# Altium project Main Board V1.1.PrjPCB
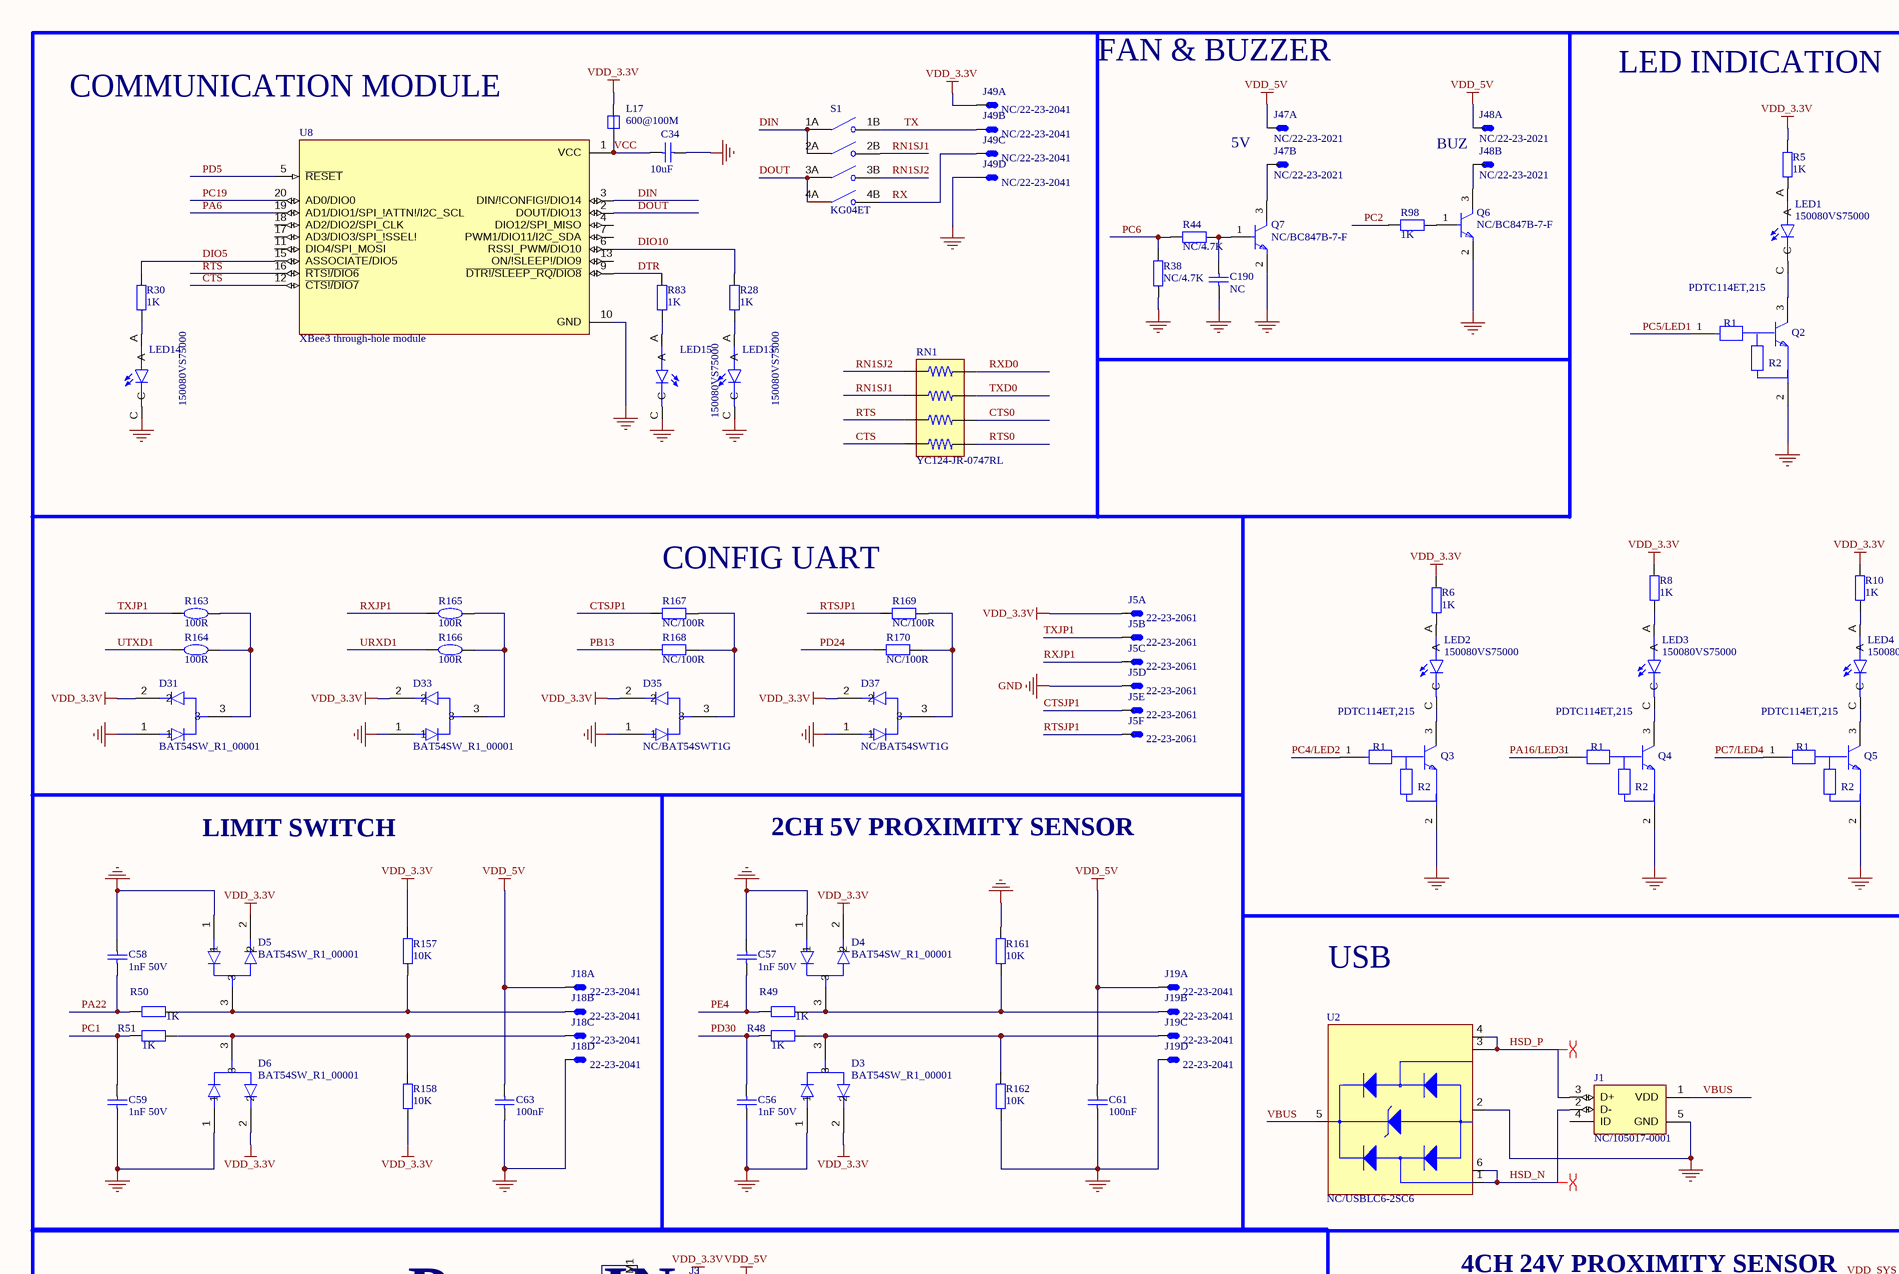
[diagram p0: Ascii of Main Board V1.1.SchDoc, top left]
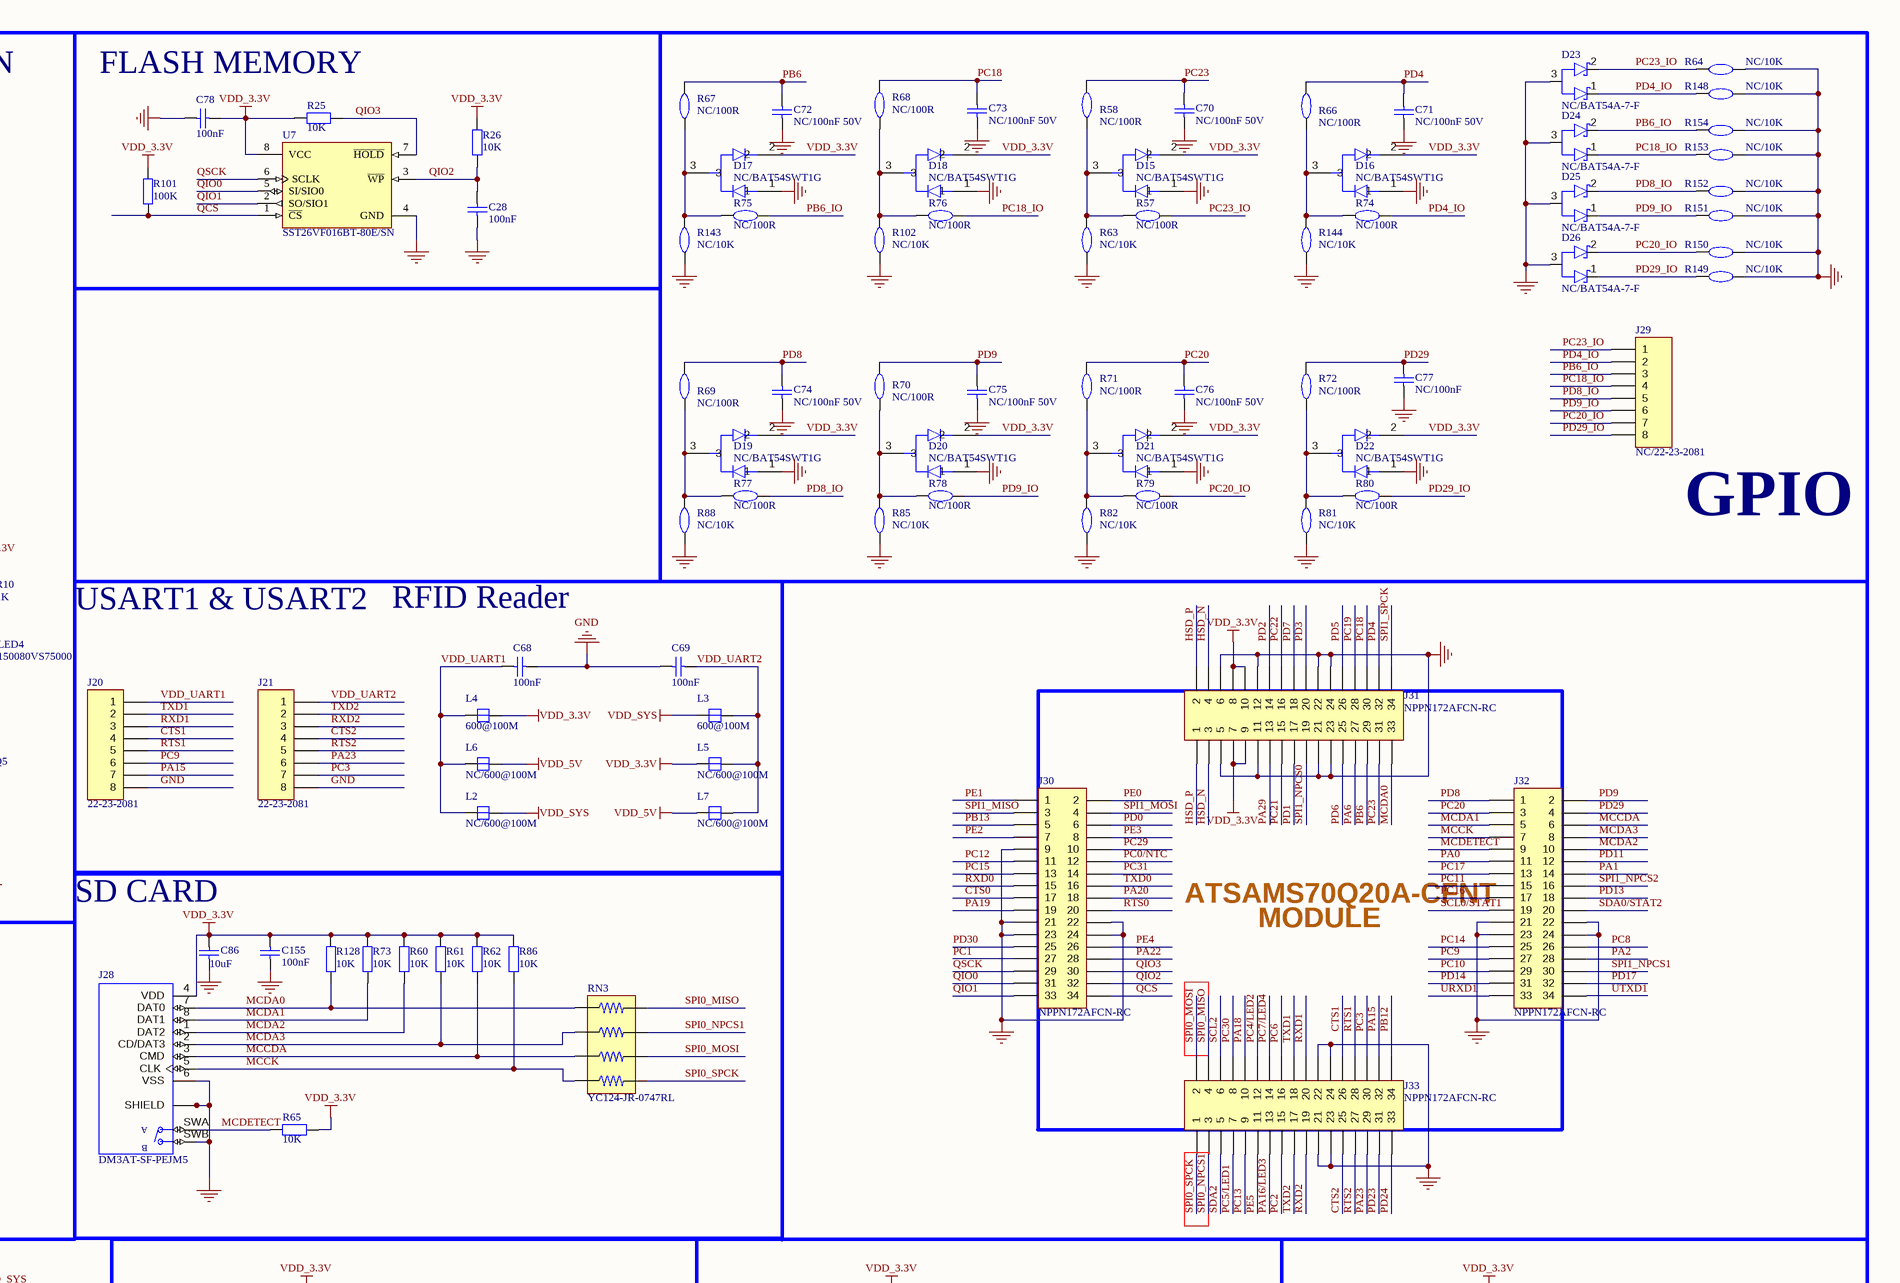
[diagram p1: Ascii of Main Board V1.1.SchDoc, top right]
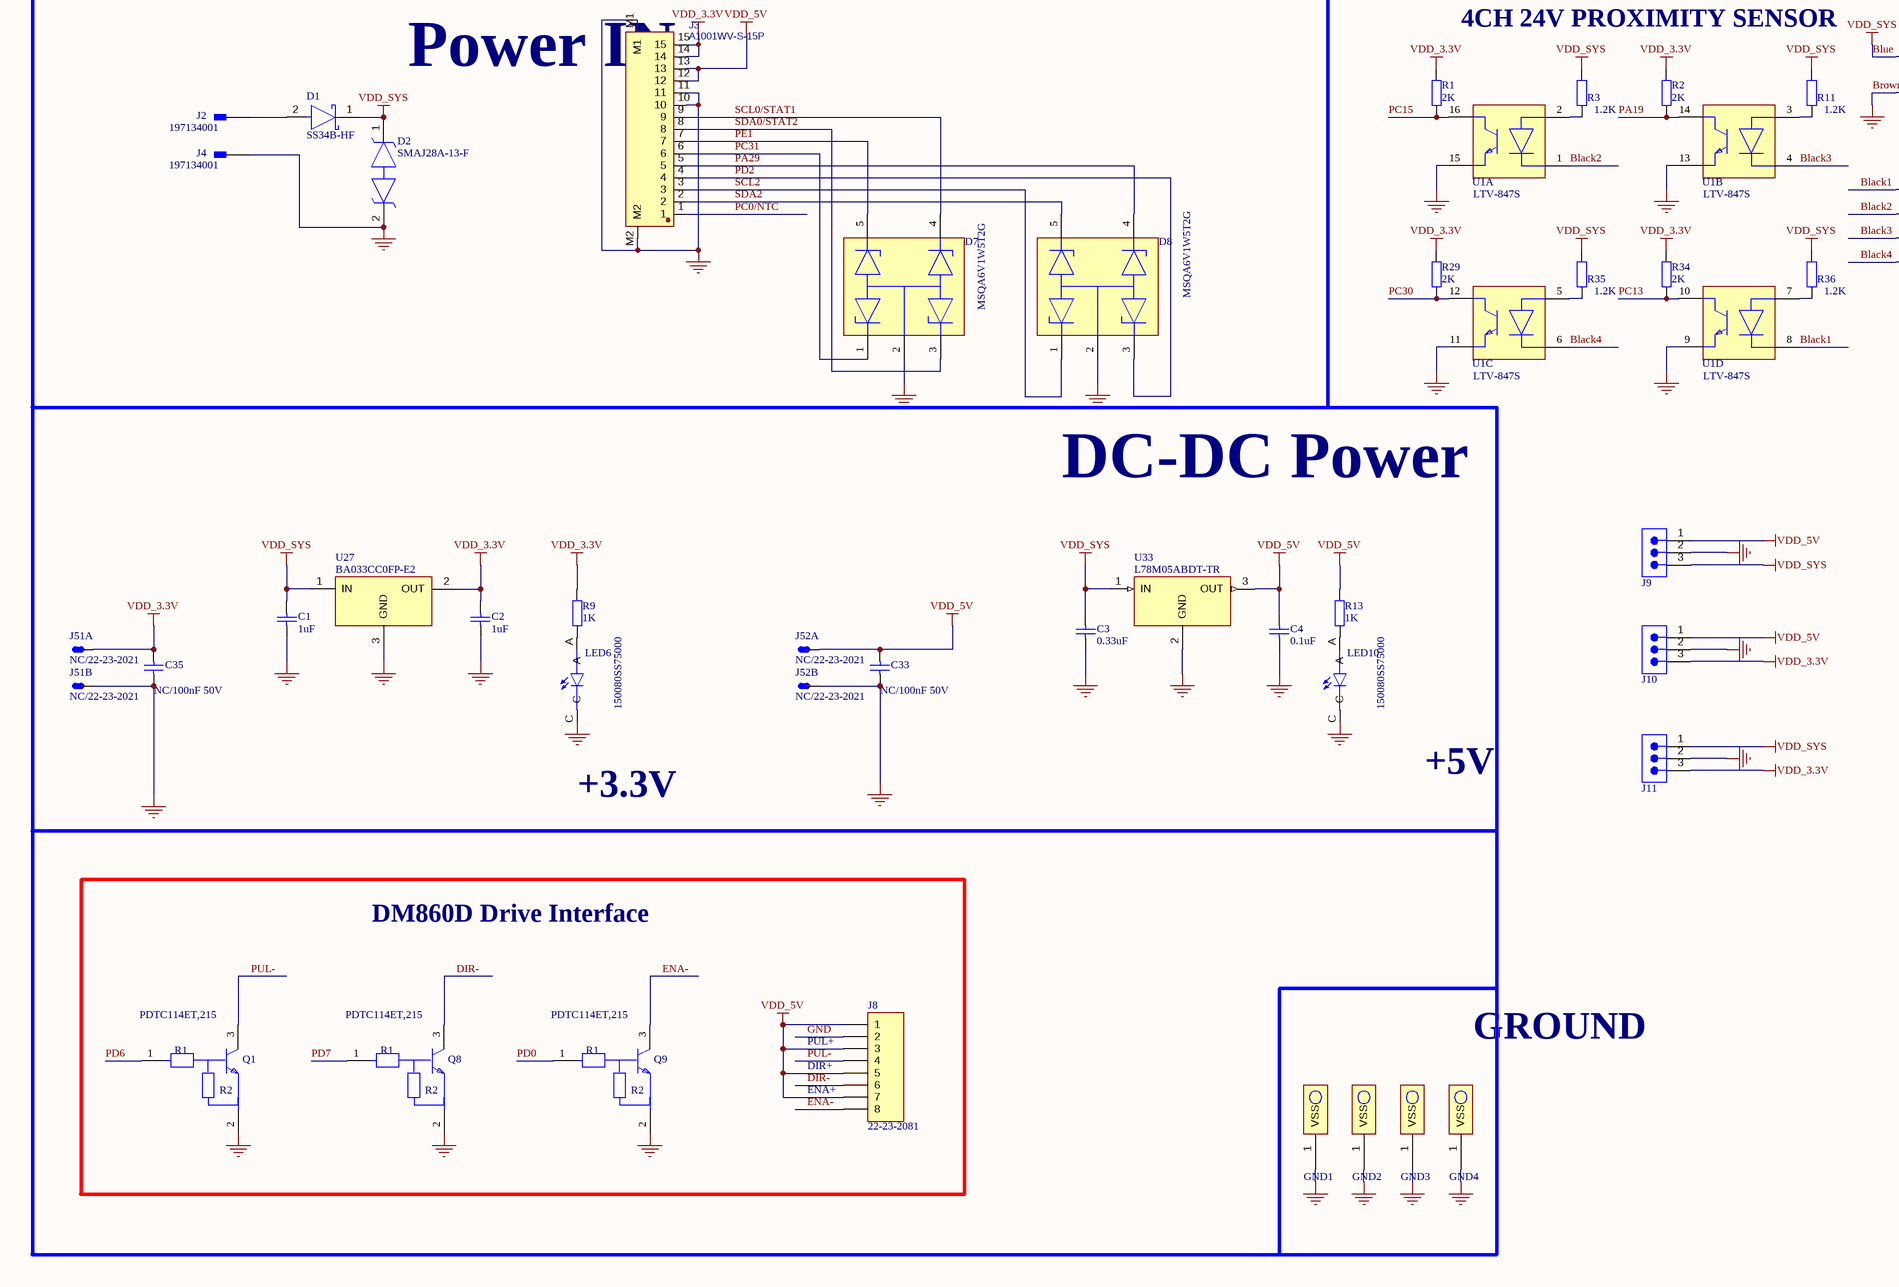
[diagram p2: Ascii of Main Board V1.1.SchDoc, bottom left]
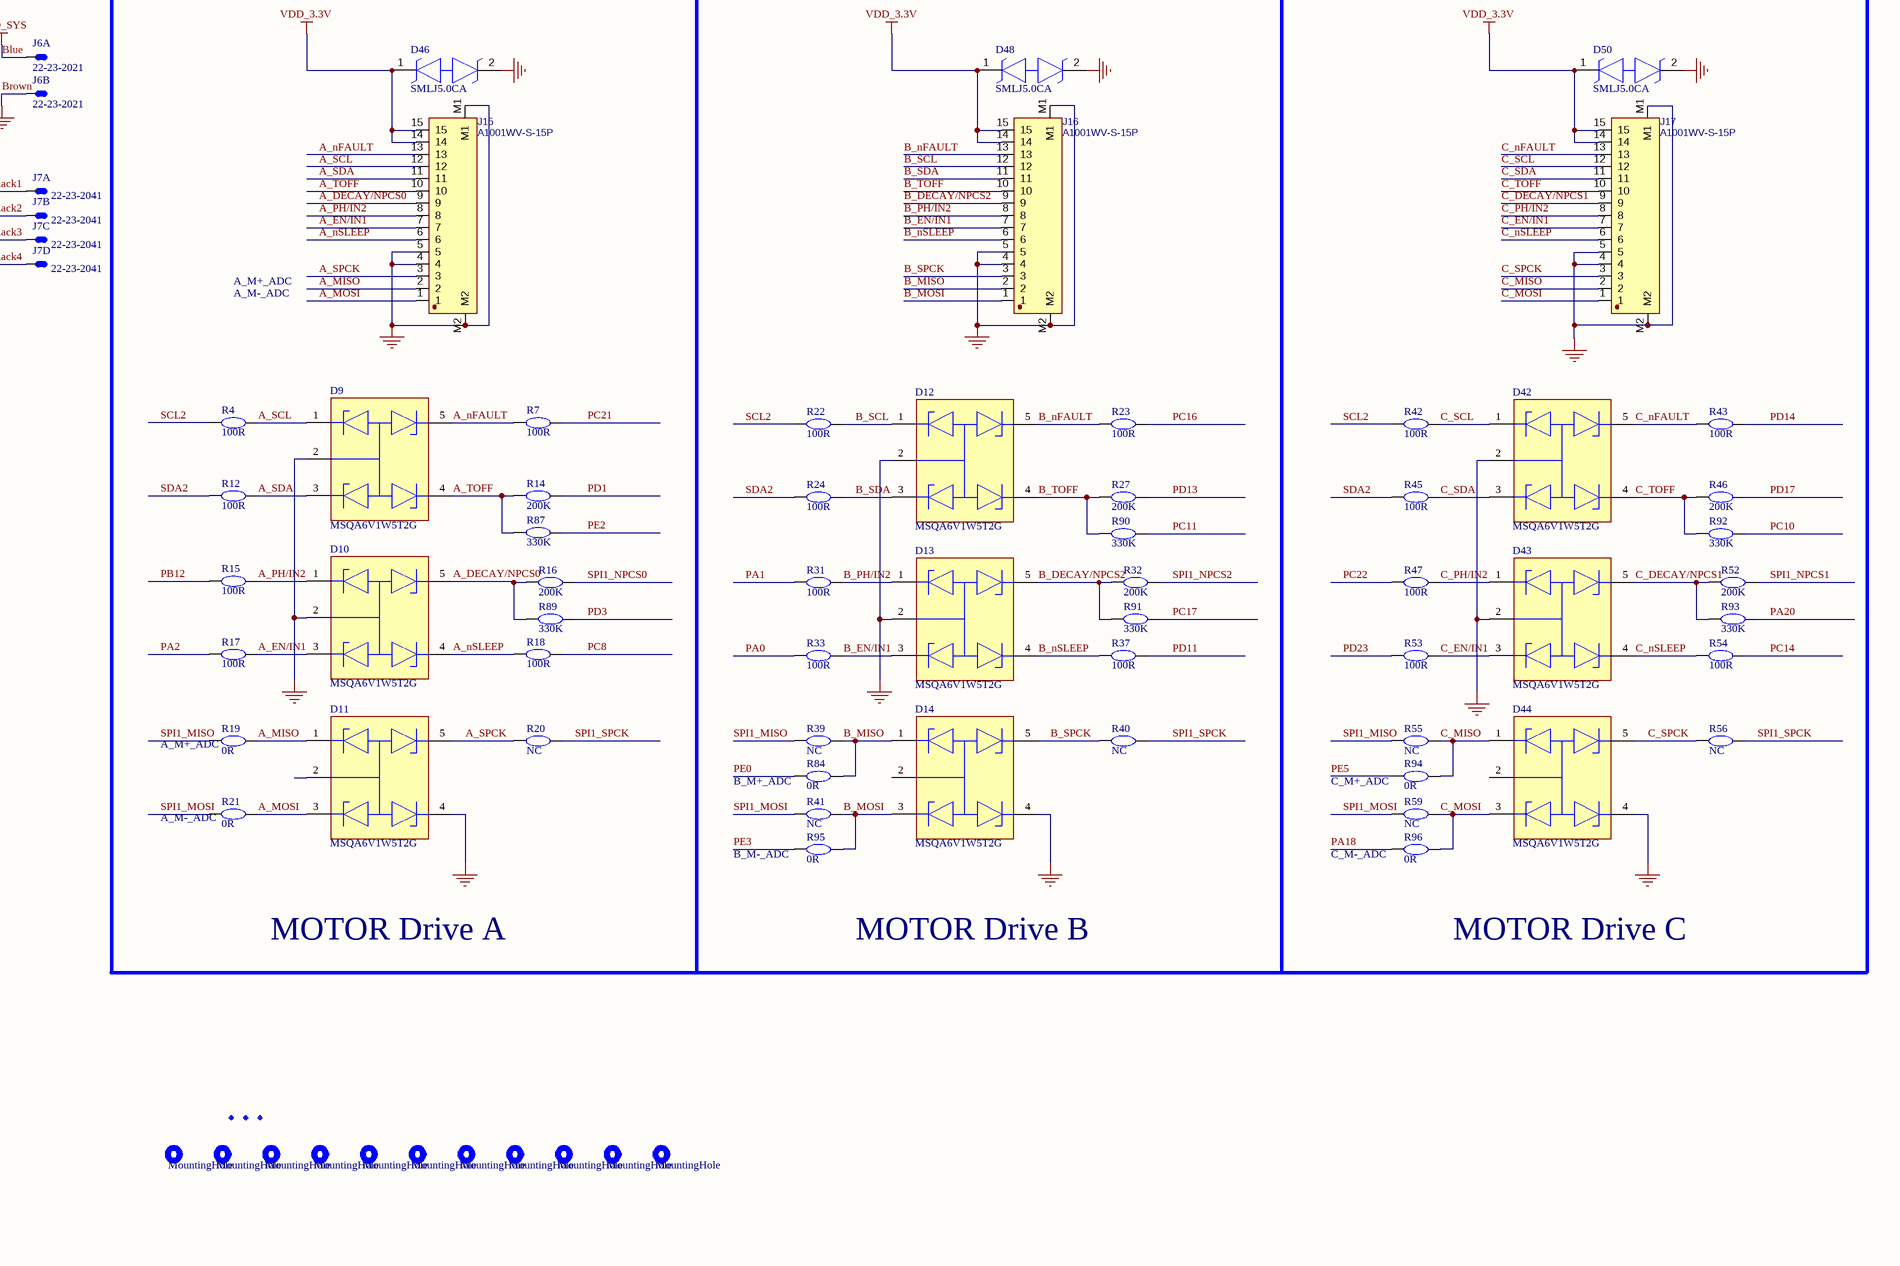
[diagram p3: Ascii of Main Board V1.1.SchDoc, bottom right]
1 sheet, 266 parts. Net scope: global (net labels, ports and power ports of the same name join across sheets).
Board file: Ascii of Main Board V1.1.PcbDoc

## Sheet Ascii of Main Board V1.1.SchDoc
size 863 x 558 mm

### Parts
C1  1uF  [C_0603_1608Metric]
C2  1uF  [C_0603_1608Metric]
C3  0.33uF  [C_0603_1608Metric]
C4  0.1uF  [C_0603_1608Metric]
C28  100nF  [C_0603_1608Metric]
C33  NC/100nF 50V  [C_0603_1608Metric]
C34  10uF  [C_1206_3216Metric]
C35  NC/100nF 50V  [C_0603_1608Metric]
C56  1nF 50V  [C_0603_1608Metric]
C57  1nF 50V  [C_0603_1608Metric]
C58  1nF 50V  [C_0603_1608Metric]
C59  1nF 50V  [C_0603_1608Metric]
C61  100nF  [C_0603_1608Metric]
C63  100nF  [C_0603_1608Metric]
C68  100nF  [C_0603_1608Metric]
C69  100nF  [C_0603_1608Metric]
C70  NC/100nF 50V  [C_0603_1608Metric]
C71  NC/100nF 50V  [C_0603_1608Metric]
C72  NC/100nF 50V  [C_0603_1608Metric]
C73  NC/100nF 50V  [C_0603_1608Metric]
C74  NC/100nF 50V  [C_0603_1608Metric]
C75  NC/100nF 50V  [C_0603_1608Metric]
C76  NC/100nF 50V  [C_0603_1608Metric]
C77  NC/100nF  [C_0603_1608Metric]
C78  100nF  [C_0603_1608Metric]
C86  10uF  [C_1206_3216Metric]
C155  100nF  [C_0603_1608Metric]
C190  NC  [C_0603_1608Metric]
D1  SS34B-HF  [FP-95402-MFG]
D2  SMAJ28A-13-F  [DIONM7959X262N]
D3  BAT54SW_R1_00001  [ONSC-SOT-323-3-419-04_V]
D4  BAT54SW_R1_00001  [ONSC-SOT-323-3-419-04_V]
D5  BAT54SW_R1_00001  [ONSC-SOT-323-3-419-04_V]
D6  BAT54SW_R1_00001  [ONSC-SOT-323-3-419-04_V]
D7  MSQA6V1W5T2G  [SOT95P280X145-5N]
D8  MSQA6V1W5T2G  [SOT95P280X145-5N]
D9  MSQA6V1W5T2G  [SOT95P280X145-5N]
D10  MSQA6V1W5T2G  [SOT95P280X145-5N]
D11  MSQA6V1W5T2G  [SOT95P280X145-5N]
D12  MSQA6V1W5T2G  [SOT95P280X145-5N]
D13  MSQA6V1W5T2G  [SOT95P280X145-5N]
D14  MSQA6V1W5T2G  [SOT95P280X145-5N]
D15  NC/BAT54SWT1G  [ONSC-SOT-323-3-419-04_V]
D16  NC/BAT54SWT1G  [ONSC-SOT-323-3-419-04_V]
D17  NC/BAT54SWT1G  [ONSC-SOT-323-3-419-04_V]
D18  NC/BAT54SWT1G  [ONSC-SOT-323-3-419-04_V]
D19  NC/BAT54SWT1G  [ONSC-SOT-323-3-419-04_V]
D20  NC/BAT54SWT1G  [ONSC-SOT-323-3-419-04_V]
D21  NC/BAT54SWT1G  [ONSC-SOT-323-3-419-04_V]
D22  NC/BAT54SWT1G  [ONSC-SOT-323-3-419-04_V]
D23  NC/BAT54A-7-F  [ONSC-SOT-323-3-419-04_V]
D24  NC/BAT54A-7-F  [ONSC-SOT-323-3-419-04_V]
D25  NC/BAT54A-7-F  [ONSC-SOT-323-3-419-04_V]
D26  NC/BAT54A-7-F  [ONSC-SOT-323-3-419-04_V]
D31  BAT54SW_R1_00001  [ONSC-SOT-323-3-419-04_V]
D33  BAT54SW_R1_00001  [ONSC-SOT-323-3-419-04_V]
D35  NC/BAT54SWT1G  [ONSC-SOT-323-3-419-04_V]
D37  NC/BAT54SWT1G  [ONSC-SOT-323-3-419-04_V]
D42  MSQA6V1W5T2G  [SOT95P280X145-5N]
D43  MSQA6V1W5T2G  [SOT95P280X145-5N]
D44  MSQA6V1W5T2G  [SOT95P280X145-5N]
D46  SMLJ5.0CA  [DIONM7959X262N]
D48  SMLJ5.0CA  [DIONM7959X262N]
D50  SMLJ5.0CA  [DIONM7959X262N]
Fid1  Fiducial mark  [Fiducial_1mm_Mask2mm]  (value not drawn)  (no BOM)
Fid2  Fiducial mark  [Fiducial_1mm_Mask2mm]  (value not drawn)  (no BOM)
Fid3  Fiducial mark  [Fiducial_1mm_Mask2mm]  (value not drawn)  (no BOM)
GND1  Ground Mark  [1X01]  (value not drawn)
GND2  Ground Mark  [1X01]  (value not drawn)
GND3  Ground Mark  [1X01]  (value not drawn)
GND4  Ground Mark  [1X01]  (value not drawn)
H1  MountingHole  [3,0-PAD]
H2  MountingHole  [3,0-PAD]
H3  MountingHole  [3,0-PAD]
H4  MountingHole  [3,0-PAD]
H5  MountingHole  [3,0-PAD]
H6  MountingHole  [3,0-PAD]
H7  MountingHole  [3,0-PAD]
H8  MountingHole  [3,0-PAD]
H9  MountingHole  [3,0-PAD]
H10  MountingHole  [3,0-PAD]
H11  MountingHole  [3,0-PAD]
J1  NC/105017-0001  [MOLEX_105017-0001]
J2  197134001  [Crimp male 90 degree 0.25(6.35mm)]
J3  A1001WV-S-15P  [SH1.0 1X15P SMT VERTICAL]
J4  197134001  [Crimp male 90 degree 0.25(6.35mm)]
J5  22-23-2061  [22-23-2061]  (parts A,B,C,D,E,F of 6)
J6  22-23-2021  [22-23-2021]  (parts A,B of 2)
J7  22-23-2041  [22-23-2041]  (parts A,B,C,D of 4)
J8  22-23-2081  [22-23-2081]
J9  61300311121  [61300311121]  (value not drawn)
J10  61300311121  [61300311121]  (value not drawn)
J11  61300311121  [61300311121]  (value not drawn)
J15  A1001WV-S-15P  [SH1.0 1X15P SMT VERTICAL]
J16  A1001WV-S-15P  [SH1.0 1X15P SMT VERTICAL]
J17  A1001WV-S-15P  [SH1.0 1X15P SMT VERTICAL]
J18  22-23-2041  [22-23-2041]  (parts A,B,C,D of 4)
J19  22-23-2041  [22-23-2041]  (parts A,B,C,D of 4)
J20  22-23-2081  [22-23-2081]
J21  22-23-2081  [22-23-2081]
J28  DM3AT-SF-PEJM5  [HRS_DM3AT-SF-PEJM5]
J29  NC/22-23-2081  [22-23-2081]
J30  NPPN172AFCN-RC  [HDR-TH_34P-P2.00-V-M-R2-C17-S2.00]
J31  NPPN172AFCN-RC  [HDR-TH_34P-P2.00-V-M-R2-C17-S2.00]
J32  NPPN172AFCN-RC  [HDR-TH_34P-P2.00-V-M-R2-C17-S2.00]
J33  NPPN172AFCN-RC  [HDR-TH_34P-P2.00-V-M-R2-C17-S2.00]
J47  NC/22-23-2021  [22-23-2021]  (parts A,B of 2)
J48  NC/22-23-2021  [22-23-2021]  (parts A,B of 2)
J49  NC/22-23-2041  [22-23-2041]  (parts A,B,C,D of 4)
J51  NC/22-23-2021  [22-23-2021]  (parts A,B of 2)
J52  NC/22-23-2021  [22-23-2021]  (parts A,B of 2)
L2  NC/600@100M  [L_0603_1608Metric]
L3  600@100M  [L_0603_1608Metric]
L4  600@100M  [L_0603_1608Metric]
L5  NC/600@100M  [L_0603_1608Metric]
L6  NC/600@100M  [L_0603_1608Metric]
L7  NC/600@100M  [L_0603_1608Metric]
L17  600@100M  [L_0603_1608Metric]
LED1  150080VS75000  [LEDC2012X120N]
LED2  150080VS75000  [LEDC2012X120N]
LED3  150080VS75000  [LEDC2012X120N]
LED4  150080VS75000  [LEDC2012X120N]
LED6  150080SS75000  [LEDC2012X120N]
LED10  150080SS75000  [LEDC2012X120N]
LED13  150080VS75000  [LEDC2012X120N]
LED14  150080VS75000  [LEDC2012X120N]
LED15  150080VS75000  [LEDC2012X120N]
Q1  PDTC114ET,215  [SOT95P230X110-3N]
Q2  PDTC114ET,215  [SOT95P230X110-3N]
Q3  PDTC114ET,215  [SOT95P230X110-3N]
Q4  PDTC114ET,215  [SOT95P230X110-3N]
Q5  PDTC114ET,215  [SOT95P230X110-3N]
Q6  NC/BC847B-7-F  [SOT95P230X110-3N]
Q7  NC/BC847B-7-F  [SOT95P230X110-3N]
Q8  PDTC114ET,215  [SOT95P230X110-3N]
Q9  PDTC114ET,215  [SOT95P230X110-3N]
R1  2K  [R_0603_1608Metric]
R2  2K  [R_0603_1608Metric]
R3  1.2K  [R_0603_1608Metric]
R4  100R  [R_0603_1608Metric]
R5  1K  [R_0603_1608Metric]
R6  1K  [R_0603_1608Metric]
R7  100R  [R_0603_1608Metric]
R8  1K  [R_0603_1608Metric]
R9  1K  [R_0603_1608Metric]
R10  1K  [R_0603_1608Metric]
R11  1.2K  [R_0603_1608Metric]
R12  100R  [R_0603_1608Metric]
R13  1K  [R_0603_1608Metric]
R14  200K  [R_0603_1608Metric]
R15  100R  [R_0603_1608Metric]
R16  200K  [R_0603_1608Metric]
R17  100R  [R_0603_1608Metric]
R18  100R  [R_0603_1608Metric]
R19  0R  [R_0603_1608Metric]
R20  NC  [R_0603_1608Metric]
R21  0R  [R_0603_1608Metric]
R22  100R  [R_0603_1608Metric]
R23  100R  [R_0603_1608Metric]
R24  100R  [R_0603_1608Metric]
R25  10K  [R_0603_1608Metric]
R26  10K  [R_0603_1608Metric]
R27  200K  [R_0603_1608Metric]
R28  1K  [R_0603_1608Metric]
R29  2K  [R_0603_1608Metric]
R30  1K  [R_0603_1608Metric]
R31  100R  [R_0603_1608Metric]
R32  200K  [R_0603_1608Metric]
R33  100R  [R_0603_1608Metric]
R34  2K  [R_0603_1608Metric]
R35  1.2K  [R_0603_1608Metric]
R36  1.2K  [R_0603_1608Metric]
R37  100R  [R_0603_1608Metric]
R38  NC/4.7K  [R_0603_1608Metric]
R39  NC  [R_0603_1608Metric]
R40  NC  [R_0603_1608Metric]
R41  NC  [R_0603_1608Metric]
R42  100R  [R_0603_1608Metric]
R43  100R  [R_0603_1608Metric]
R44  NC/4.7K  [R_0603_1608Metric]
R45  100R  [R_0603_1608Metric]
R46  200K  [R_0603_1608Metric]
R47  100R  [R_0603_1608Metric]
R48  1K  [R_0603_1608Metric]
R49  1K  [R_0603_1608Metric]
R50  1K  [R_0603_1608Metric]
R51  1K  [R_0603_1608Metric]
R52  200K  [R_0603_1608Metric]
R53  100R  [R_0603_1608Metric]
R54  100R  [R_0603_1608Metric]
R55  NC  [R_0603_1608Metric]
R56  NC  [R_0603_1608Metric]
R57  NC/100R  [R_0603_1608Metric]
R58  NC/100R  [R_0603_1608Metric]
R59  NC  [R_0603_1608Metric]
R60  10K  [R_0603_1608Metric]
R61  10K  [R_0603_1608Metric]
R62  10K  [R_0603_1608Metric]
R63  NC/10K  [R_0603_1608Metric]
R64  NC/10K  [R_0603_1608Metric]
R65  10K  [R_0603_1608Metric]
R66  NC/100R  [R_0603_1608Metric]
R67  NC/100R  [R_0603_1608Metric]
R68  NC/100R  [R_0603_1608Metric]
R69  NC/100R  [R_0603_1608Metric]
R70  NC/100R  [R_0603_1608Metric]
R71  NC/100R  [R_0603_1608Metric]
R72  NC/100R  [R_0603_1608Metric]
R73  10K  [R_0603_1608Metric]
R74  NC/100R  [R_0603_1608Metric]
R75  NC/100R  [R_0603_1608Metric]
R76  NC/100R  [R_0603_1608Metric]
R77  NC/100R  [R_0603_1608Metric]
R78  NC/100R  [R_0603_1608Metric]
R79  NC/100R  [R_0603_1608Metric]
R80  NC/100R  [R_0603_1608Metric]
R81  NC/10K  [R_0603_1608Metric]
R82  NC/10K  [R_0603_1608Metric]
R83  1K  [R_0603_1608Metric]
R84  0R  [R_0603_1608Metric]
R85  NC/10K  [R_0603_1608Metric]
R86  10K  [R_0603_1608Metric]
R87  330K  [R_0603_1608Metric]
R88  NC/10K  [R_0603_1608Metric]
R89  330K  [R_0603_1608Metric]
R90  330K  [R_0603_1608Metric]
R91  330K  [R_0603_1608Metric]
R92  330K  [R_0603_1608Metric]
R93  330K  [R_0603_1608Metric]
R94  0R  [R_0603_1608Metric]
R95  0R  [R_0603_1608Metric]
R96  0R  [R_0603_1608Metric]
R98  1K  [R_0603_1608Metric]
R101  100K  [R_0603_1608Metric]
R102  NC/10K  [R_0603_1608Metric]
R128  10K  [R_0603_1608Metric]
R143  NC/10K  [R_0603_1608Metric]
R144  NC/10K  [R_0603_1608Metric]
R148  NC/10K  [R_0603_1608Metric]
R149  NC/10K  [R_0603_1608Metric]
R150  NC/10K  [R_0603_1608Metric]
R151  NC/10K  [R_0603_1608Metric]
R152  NC/10K  [R_0603_1608Metric]
R153  NC/10K  [R_0603_1608Metric]
R154  NC/10K  [R_0603_1608Metric]
R157  10K  [R_0603_1608Metric]
R158  10K  [R_0603_1608Metric]
R161  10K  [R_0603_1608Metric]
R162  10K  [R_0603_1608Metric]
R163  100R  [R_0603_1608Metric]
R164  100R  [R_0603_1608Metric]
R165  100R  [R_0603_1608Metric]
R166  100R  [R_0603_1608Metric]
R167  NC/100R  [R_0603_1608Metric]
R168  NC/100R  [R_0603_1608Metric]
R169  NC/100R  [R_0603_1608Metric]
R170  NC/100R  [R_0603_1608Metric]
RN1  YC124-JR-0747RL  [RESCAXS50P200X100X55-8N]
RN3  YC124-JR-0747RL  [RESCAXS50P200X100X55-8N]
S1  KG04ET  [SW_DS01-254-S-04BE]
U1  LTV-847S  [SMD-16 19.84X7.62MM P2.54mm]  (parts A,B,C,D of 4)
U2  NC/USBLC6-2SC6  [SOT95P280X145-6N]
U7  SST26VF016BT-80E/SN  [SOIC-8]
U8  XBee3 through-hole module  [XB3-24Z8PT-J]
U27  BA033CC0FP-E2  [ROHM_TO-252-3]
U33  L78M05ABDT-TR  [VREG_L78M05ABDT-TR]

### Blocks framed on the sheet
COMMUNICATION MODULE: C34 J49 L17 LED13-LED15 R28 R30 R83 RN1 S1 U8
FAN & BUZZER: C190 J47 J48 Q6 Q7 R38 R44 R98
FLASH MEMORY: C28 C78 R25 R26 R101 U7
GPIO: C70-C77 D15-D26 J29 R57 R58 R63 R64 R66-R72 R74-R82 R85 R88 R102 R143 R144 R148-R154
CONFIG UART: D31 D33 D35 D37 J5 R163-R170
LIMIT SWITCH: C58 C59 C63 D5 D6 J18 R50 R51 R157 R158
2CH 5V PROXIMITY SENSOR: C56 C57 C61 D3 D4 J19 R48 R49 R161 R162
SD CARD: C86 C155 J28 R60-R62 R65 R73 R86 R128 RN3
Power IN: D1 D2 D7 D8 J2-J4
MOTOR Drive A: D9-D11 D46 J15 R4 R7 R12 R14-R21 R87 R89
MOTOR Drive B: D12-D14 D48 J16 R22-R24 R27 R31-R33 R37 R39-R41 R84 R90 R91 R95
MOTOR Drive C: D42-D44 D50 J17 R42 R43 R45-R47 R52-R56 R59 R92-R94 R96
DC-DC Power: C1-C4 C33 C35 J51 J52 LED6 LED10 R9 R13 U27 U33
DM860D Drive Interface: J8 Q1 Q8 Q9
GROUND: GND1-GND4

### Nets
GND: C1.1 C2.1 C3.1 C4.1 C28.1 C33.1 C34.1 C35.1 C56.1 C57.1 C58.1 C59.1 C61.1 C63.1 C68.2 C69.1 C70.2 C71.2 C72.2 C73.2 C74.2 C75.2 C76.2 C77.2 C78.1 C86.1 C155.1 C190.1 D2.2 D3.1 D4.1 D5.1 D6.1 D7.2(common_anode) D8.2(common_anode) D9.2(common_anode) D10.2(common_anode) D11.4(3_cathode) D12.2(common_anode) D13.2(common_anode) D14.4(3_cathode) D15.1 D16.1 D17.1 D18.1 D19.1 D20.1 D21.1 D22.1 D23.3(CA) D24.3(CA) D25.3(CA) D26.3(CA) D31.1 D33.1 D35.1 D37.1 D42.2(common_anode) D43.2(common_anode) D44.4(3_cathode) D46.2 D48.2 D50.2 GND1.1(VSS) GND2.1(VSS) GND3.1(VSS) GND4.1(VSS) J1.5(GND) J3.10 J3.11 J3.M1 J3.M2 J4.1 J5.4(S) J6.2(S) J8.2 J9.2 J10.2 J11.2 J15.4 J15.5 J15.M1 J15.M2 J16.4 J16.5 J16.M1 J16.M2 J17.4 J17.5 J17.M1 J17.M2 J18.4(S) J19.4(S) J20.8 J21.8 J28.6(VSS) J28.P1(SHIELD) J28.P2(SHIELD) J28.P3(SHIELD) J28.P4(SHIELD) J28.SWB(B) J30.9 J30.21 J30.22 J30.23 J30.24 J31.5 J31.6 J31.11 J31.12 J31.21 J31.22 J31.23 J31.24 J32.21 J32.22 J32.23 J32.24 J33.21 J33.22 J33.23 J33.24 J49.4(S) J51.2(S) J52.2(S) LED6.C LED10.C LED13.C LED14.C LED15.C Q1.2(GND(emitter)) Q2.2(GND(emitter)) Q3.2(GND(emitter)) Q4.2(GND(emitter)) Q5.2(GND(emitter)) Q6.2(E) Q7.2(E) Q8.2(GND(emitter)) Q9.2(GND(emitter)) R38.1 R63.2 R64.2 R81.2 R82.2 R85.2 R88.2 R102.2 R143.2 R144.2 R148.2 R149.2 R150.2 R151.2 R152.2 R153.2 R154.2 R161.2 R162.1 U1.9(E) U1.11(E) U1.13(E) U1.15(E) U2.2(GND) U7.4(GND) U8.10(GND) U27.3(GND) U33.2(GND)
VDD_3.3V: C2.2 C35.2 C78.2 C86.2 C155.2 D3.2 D4.2 D5.2 D6.2 D15.2 D16.2 D17.2 D18.2 D19.2 D20.2 D21.2 D22.2 D31.2 D33.2 D35.2 D37.2 D46.1 D48.1 D50.1 J3.14 J3.15 J5.1(S) J10.3 J11.3 J15.14 J15.15 J16.14 J16.15 J17.14 J17.15 J28.4(VDD) J31.7 J31.8 J31.9 J31.10 J49.1(S) J51.1(S) L4.2 L5.1 L17.2 R1.2 R2.2 R5.2 R6.2 R8.2 R9.2 R10.2 R25.2 R26.2 R29.2 R34.2 R60.1 R61.1 R62.1 R65.1 R73.1 R86.1 R101.2 R128.2 R157.2 R158.1 U7.8(VCC) U27.2(OUT)
VDD_5V: C4.2 C33.2 C61.2 C63.2 J3.12 J3.13 J8.1 J8.3 J8.5 J8.7 J9.1 J10.1 J18.1(S) J19.1(S) J47.1(S) J48.1(S) J52.1(S) L6.2 L7.1 R13.2 U33.3(OUT)
VDD_SYS: C1.2 C3.2 D1.1(C) D2.1 J6.1(S) J9.3 J11.1 L2.2 L3.1 R3.2 R11.2 R35.2 R36.2 U27.1(IN) U33.1(IN)
A_DECAY/NPCS0: D10.5(5_cathode) J15.9 R16.1 R89.1
A_EN/IN1: D10.3(2_cathode) J15.7 R17.2
A_MISO: D11.1(1_cathode) J15.2 R19.2
A_MOSI: D11.3(2_cathode) J15.1 R21.2
A_nFAULT: D9.5(5_cathode) J15.13 R7.1
A_nSLEEP: D10.4(3_cathode) J15.6 R18.1
A_PH/IN2: D10.1(1_cathode) J15.8 R15.2
A_SCL: D9.1(1_cathode) J15.12 R4.2
A_SDA: D9.3(2_cathode) J15.11 R12.2
A_SPCK: D11.5(5_cathode) J15.3 R20.1
A_TOFF: D9.4(3_cathode) J15.10 R14.1 R87.1
B_DECAY/NPCS2: D13.5(5_cathode) J16.9 R32.1 R91.1
B_EN/IN1: D13.3(2_cathode) J16.7 R33.2
B_MISO: D14.1(1_cathode) J16.2 R39.2 R84.2
B_MOSI: D14.3(2_cathode) J16.1 R41.2 R95.2
B_nFAULT: D12.5(5_cathode) J16.13 R23.1
B_nSLEEP: D13.4(3_cathode) J16.6 R37.1
B_PH/IN2: D13.1(1_cathode) J16.8 R31.2
B_SCL: D12.1(1_cathode) J16.12 R22.2
B_SDA: D12.3(2_cathode) J16.11 R24.2
B_SPCK: D14.5(5_cathode) J16.3 R40.1
B_TOFF: D12.4(3_cathode) J16.10 R27.1 R90.1
Black1: J7.1(S) U1.8(4_Cathode)
Black2: J7.2(S) U1.1(1_Anode)
Black3: J7.3(S) U1.4(2_Cathode)
Black4: J7.4(S) U1.6(3_Cathode)
C_DECAY/NPCS1: D43.5(5_cathode) J17.9 R52.1 R93.1
C_EN/IN1: D43.3(2_cathode) J17.7 R53.2
C_MISO: D44.1(1_cathode) J17.2 R55.2 R94.2
C_MOSI: D44.3(2_cathode) J17.1 R59.2 R96.2
C_nFAULT: D42.5(5_cathode) J17.13 R43.1
C_nSLEEP: D43.4(3_cathode) J17.6 R54.1
C_PH/IN2: D43.1(1_cathode) J17.8 R47.2
C_SCL: D42.1(1_cathode) J17.12 R42.2
C_SDA: D42.3(2_cathode) J17.11 R45.2
C_SPCK: D44.5(5_cathode) J17.3 R56.1
C_TOFF: D42.4(3_cathode) J17.10 R46.1 R92.1
CTS: RN1.4 U8.12(~{CTS!/DIO7})
CTS0: J30.17 RN1.6
CTS1: J20.4 J33.26
CTS2: J21.4 J33.25
CTSJP1: J5.5(S) R167.1
DIN: S1.1A(COM1) S1.2A(COM2) U8.3(DIN/!CONFIG!/DIO14)
DIO5: R30.1 U8.15(ASSOCIATE/DIO5)
DIO10: R28.1 U8.6(RSSI_PWM/DIO10)
DIR-: J8.6 Q8.3(output(collector))
DOUT: S1.3A(COM3) S1.4A(COM4) U8.2(DOUT/DIO13)
DTR: R83.1 U8.9(~{DTR!/SLEEP_RQ/DIO8})
ENA-: J8.8 Q9.3(output(collector))
HSD_N: J1.2(D-) J31.3 J31.4 U2.1(I/O1) U2.6(I/O1)
HSD_P: J1.3(D+) J31.1 J31.2 U2.3(I/O2) U2.4(I/O2)
MCCDA: J28.3(CMD) J32.6 R62.2 RN3.3
MCCK: J28.5(CLK) J32.7 R86.2 RN3.4
MCDA0: J28.7(DAT0) J31.33 R128.1 RN3.1
MCDA1: J28.8(DAT1) J32.5 R73.2
MCDA2: J28.1(DAT2) J32.10 R60.2
MCDA3: J28.2(CD/DAT3) J32.8 R61.2 RN3.2
MCDETECT: J28.SWA(A) J32.9 R65.2
PA0: J32.11 R33.1
PA1: J32.14 R31.1
PA2: J32.28 R17.1
PA6: J31.27 U8.19(AD1/DIO1/SPI_!ATTN!/I2C_SCL)
PA15: J20.7 J33.32
PA16/LED3: J33.13 Q4.1(input(base))
PA18: J33.10 R96.1
PA19: J30.19 R2.1 U1.14(C)
PA20: J30.18 R93.2
PA22: C58.2 J30.28 R50.1
PA23: J21.6 J33.29
PA29: D8.4(3_cathode) J3.5 J31.13
PB6: C72.1 J31.29 R67.1
PB6_IO: D24.2(C2) J29.3 R75.2 R154.1
PB12: J33.34 R15.1
PB13: J30.5 R168.1
PC0/NTC: J3.1 J30.12
PC1: C59.2 J30.27 R51.1
PC2: J33.15 R98.1
PC3: J21.7 J33.30
PC4/LED2: J33.12 Q3.1(input(base))
PC5/LED1: J33.7 Q2.1(input(base))
PC6: J33.16 R38.2 R44.2
PC7/LED4: J33.14 Q5.1(input(base))
PC8: J32.26 R18.2
PC9: J20.6 J32.27
PC10: J32.29 R92.2
PC11: J32.15 R90.2
PC12: J30.11
PC13: J33.9 R34.1 U1.10(C)
PC14: J32.25 R54.2
PC15: J30.13 R1.1 U1.16(C)
PC16: J32.17 R23.2
PC17: J32.13 R91.2
PC18: C73.1 J31.30 R68.1
PC18_IO: D24.1(C1) J29.4 R76.2 R153.1
PC19: J31.28 U8.20(AD0/DIO0)
PC20: C76.1 J32.3 R71.1
PC20_IO: D26.2(C2) J29.7 R79.2 R150.1
PC21: J31.15 R7.2
PC22: J31.16 R47.1
PC23: C70.1 J31.31 R58.1
PC23_IO: D23.2(C2) J29.1 R57.2 R64.1
PC29: J30.10
PC30: J33.8 R29.1 U1.12(C)
PC31: D7.1(1_cathode) J3.6 J30.14
PD0: J30.6 Q9.1(input(base))
PD1: J31.17 R14.2
PD2: D8.3(2_cathode) J3.4 J31.14
PD3: J31.20 R89.2
PD4: C71.1 J31.32 R66.1
PD4_IO: D23.1(C1) J29.2 R74.2 R148.1
PD5: J31.26 U8.5(~{RESET})
PD6: J31.25 Q1.1(input(base))
PD7: J31.18 Q8.1(input(base))
PD8: C74.1 J32.1 R69.1
PD8_IO: D25.2(C2) J29.5 R77.2 R152.1
PD9: C75.1 J32.2 R70.1
PD9_IO: D25.1(C1) J29.6 R78.2 R151.1
PD11: J32.12 R37.2
PD13: J32.18 R27.2
PD14: J32.31 R43.2
PD17: J32.32 R46.2
PD23: J33.31 R53.1
PD24: J33.33 R170.1
PD29: C77.1 J32.4 R72.1
PD29_IO: D26.1(C1) J29.8 R80.2 R149.1
PD30: C56.2 J30.25 R48.1
PE0: J30.2 R84.1
PE1: D7.5(5_cathode) J3.7 J30.1
PE2: J30.7 R87.2
PE3: J30.8 R95.1
PE4: C57.2 J30.26 R49.1
PE5: J33.11 R94.1
PUL-: J8.4 Q1.3(output(collector))
QCS: J30.34 R101.1 U7.1(~{CS})
QIO0: J30.31 U7.5(SI/SIO0)
QIO1: J30.33 U7.2(SO/SIO1)
QIO2: C28.2 J30.32 R26.1 U7.3(~{WP})
QIO3: J30.30 R25.1 U7.7(~{HOLD})
QSCK: J30.29 U7.6(SCLK)
RN1SJ1: RN1.2 S1.2B(NO2)
RN1SJ2: RN1.1 S1.3B(NO3)
RTS: RN1.3 U8.16(~{RTS!/DIO6})
RTS0: J30.20 RN1.5
RTS1: J20.5 J33.28
RTS2: J21.5 J33.27
RTSJP1: J5.6(S) R169.1
RX: J49.3(S) S1.4B(NO4)
RXD0: J30.15 RN1.8
RXD1: J20.3 J33.20
RXD2: J21.3 J33.19
RXJP1: J5.3(S) R165.1
SCL0/STAT1: D7.4(3_cathode) J3.9 J32.19
SCL2: D8.1(1_cathode) J3.3 J33.6 R4.1 R22.1 R42.1
SDA0/STAT2: D7.3(2_cathode) J3.8 J32.20
SDA2: D8.5(5_cathode) J3.2 J33.5 R12.1 R24.1 R45.1
SPI0_MISO: J33.4 RN3.8
SPI0_MOSI: J33.2 RN3.6
SPI0_NPCS1: J33.3 RN3.7
SPI0_SPCK: J33.1 RN3.5
SPI1_MISO: J30.3 R19.1 R39.1 R55.1
SPI1_MOSI: J30.4 R21.1 R41.1 R59.1
SPI1_NPCS0: J31.19 R16.2
SPI1_NPCS1: J32.30 R52.2
SPI1_NPCS2: J32.16 R32.2
SPI1_SPCK: J31.34 R20.2 R40.2 R56.2
TX: J49.2(S) S1.1B(NO1)
TXD0: J30.16 RN1.7
TXD1: J20.2 J33.18
TXD2: J21.2 J33.17
TXJP1: J5.2(S) R163.1
URXD1: J32.33 R166.1
UTXD1: J32.34 R164.1
VBUS: J1.1(VDD) U2.5(VBUS)
VCC: C34.2 L17.1 U8.1(VCC)
VDD_UART1: C68.1 J20.1 L2.1 L4.1 L6.1
VDD_UART2: C69.2 J21.1 L3.2 L5.2 L7.2
NetC190_2: C190.2 Q7.1(B) R44.1
NetD1_2: D1.2(A) J2.1
NetD3_3: D3.3 J19.3(S) R48.2 R162.2
NetD4_3: D4.3 J19.2(S) R49.2 R161.1
NetD5_3: D5.3 J18.2(S) R50.2 R157.1
NetD6_3: D6.3 J18.3(S) R51.2 R158.2
NetD15_3: D15.3 R57.1 R58.2 R63.1
NetD16_3: D16.3 R66.2 R74.1 R144.1
NetD17_3: D17.3 R67.2 R75.1 R143.1
NetD18_3: D18.3 R68.2 R76.1 R102.1
NetD19_3: D19.3 R69.2 R77.1 R88.1
NetD20_3: D20.3 R70.2 R78.1 R85.1
NetD21_3: D21.3 R71.2 R79.1 R82.1
NetD22_3: D22.3 R72.2 R80.1 R81.1
NetD31_3: D31.3 R163.2 R164.2
NetD33_3: D33.3 R165.2 R166.2
NetD35_3: D35.3 R167.2 R168.2
NetD37_3: D37.3 R169.2 R170.2
NetJ47_2: J47.2(S) Q7.3(C)
NetJ48_2: J48.2(S) Q6.3(C)
NetLED1_A: LED1.A R5.1
NetLED1_C: LED1.C Q2.3(output(collector))
NetLED2_A: LED2.A R6.1
NetLED2_C: LED2.C Q3.3(output(collector))
NetLED3_A: LED3.A R8.1
NetLED3_C: LED3.C Q4.3(output(collector))
NetLED4_A: LED4.A R10.1
NetLED4_C: LED4.C Q5.3(output(collector))
NetLED6_A: LED6.A R9.1
NetLED10_A: LED10.A R13.1
NetLED13_A: LED13.A R28.2
NetLED14_A: LED14.A R30.2
NetLED15_A: LED15.A R83.2
NetQ6_1: Q6.1(B) R98.2
NetR3_1: R3.1 U1.2(1_Cathode)
NetR11_1: R11.1 U1.3(2_Anode)
NetR35_1: R35.1 U1.5(3_Anode)
NetR36_1: R36.1 U1.7(4_Anode)

Not connected (* = marked no-connect by the designer): D11 2(common_anode); D14 2(common_anode); D44 2(common_anode); J1 4(ID); U8 4(DIO12/SPI_MISO) 7(PWM1/DIO11/I2C_SDA) 11(DIO4/SPI_MOSI) 13(ON/!SLEEP!/DIO9) 17(AD3/DIO3/SPI_!SSEL!) 18(AD2/DIO2/SPI_CLK)

### Layout directives
differential pair; differential pair class 90ohm; net class 90ohm: HSD_N, HSD_P

### Notes on the sheet
- LED INDICATION
- (near J47) 5V
- (near J48) BUZ
- USART1 & USART2
- RFID Reader
- ATSAMS70Q20A-CFNT
- MODULE
- USB
- 4CH 24V PROXIMITY SENSOR
- (near J6) Blue
- (near J6) Brown
- A_M+_ADC
- A_M-_ADC
- (near LED10) +5V
- (near R19) A_M+_ADC
- B_M+_ADC
- C_M+_ADC
- +3.3V
- (near R21) A_M-_ADC
- B_M-_ADC
- C_M-_ADC
- (near J8) PUL+
- (near J8) DIR+
- (near J8) ENA+
- DWG. NO.
- REV.
- SHT.
- REVISION
- DESCRIPTION
- DATE
- APPROVED
- THIS DOCUMENT AND THE DATA DISCLOSED HEREIN OR HEREWITH IS THE PROPERTY OF ALTIUM LIMITED AND MAY BE FREELY DISTRIBUTED IN WHOLE. NO RIGHTS ARE RESERVED OR EXPRESS OR IMPLIED WARANTEE GIVEN.
- ENG:
- DSN:
- APPROVALS
- PROJECT
- DOCUMENT REVISION:
- DESIGN ITEM:
- CHK:
- BOM:
- REFERENCE DOCUMENTS
- PROJECT REVISION:
- TITLE
- FAB DWG:
- PCB DWG:
- ASSY DWG:
- SCALE:
- SIZE
- D
- CAGE CODE
- FILE NAME
- DWG NO.
- SHEET
- OF
- REV
- (in symbol PDTC114ET,215) R1; R2

### Library data of the parts
C1 C2 = Cap Semi: CAP CER 1UF 50V X7R 0603; Published: 8-Jun-2000; LatestRevisionDate: 29-May-2009; LatestRevisionNote: IPC-7351 Footprint Added.; PackageReference: C1206; Publisher: Altium Limited; PackageDescription: Chip Capacitor
C3 = Cap Semi: CAP CER 0.33UF 50V X7R 0603; Published: 8-Jun-2000; LatestRevisionDate: 29-May-2009; LatestRevisionNote: IPC-7351 Footprint Added.; PackageReference: C1206; Publisher: Altium Limited; PackageDescription: Chip Capacitor
C4 C28 C61 C63 C68 C69 C78 C155 = Cap Semi: CAP CER 0.1UF 50V X7R 0603; Published: 8-Jun-2000; LatestRevisionDate: 29-May-2009; LatestRevisionNote: IPC-7351 Footprint Added.; PackageReference: C1206; Publisher: Altium Limited; PackageDescription: Chip Capacitor
C33 C35 = Cap Semi: 08055C103KAT2A; Published: 8-Jun-2000; LatestRevisionDate: 29-May-2009; LatestRevisionNote: IPC-7351 Footprint Added.; PackageReference: C1206; Publisher: Altium Limited; PackageDescription: Chip Capacitor; Value: 100nF 50V
C34 C86 = Cap Semi: CAP CER 10UF 50V X5R 1206; Published: 8-Jun-2000; LatestRevisionDate: 29-May-2009; LatestRevisionNote: IPC-7351 Footprint Added.; PackageReference: C1206; Publisher: Altium Limited; PackageDescription: Chip Capacitor; Value: 10uF 50V
C56-C59 = Cap Semi: CAP CER 1000PF 50V X7R 0603; Published: 8-Jun-2000; LatestRevisionDate: 29-May-2009; LatestRevisionNote: IPC-7351 Footprint Added.; PackageReference: C1206; Publisher: Altium Limited; PackageDescription: Chip Capacitor
C70-C77 = Cap Semi: 0805J0500104KXT; Published: 8-Jun-2000; LatestRevisionDate: 29-May-2009; LatestRevisionNote: IPC-7351 Footprint Added.; PackageReference: C1206; Publisher: Altium Limited; PackageDescription: Chip Capacitor
C190 = Cap Semi: DUMMY; Published: 8-Jun-2000; LatestRevisionDate: 29-May-2009; LatestRevisionNote: IPC-7351 Footprint Added.; PackageReference: C1206; Publisher: Altium Limited; PackageDescription: Chip Capacitor; Value: NC
D1 = 1d6ec82d83fb6aee721767c19dac4b9: DIODE SCHOTTKY 40V 3A DO214AB
D2 D46 D48 D50 = SMLJ43CA: TVS Diode (Bi-directional); Manufacturer_Name: Bourns; Datasheet Link: https://www.arrow.com/en/products/smlj43ca/bourns; Height: 2.62mm; Manufacturer_Part_Number: SMLJ43CA; Mouser Part Number: 652-SMLJ43CA; Mouser Price/Stock: https://www.mouser.co.uk/ProductDetail/Bourns/SMLJ43CA?qs=d7fLapxX37H4ipm6c23cIQ%3D%3D; Arrow Part Number: SMLJ43CA; Arrow Price/Stock: https://www.arrow.com/en/products/smlj43ca/bourns
D3-D6 D31 D33 = BAT54S: Diode Array 1 Pair Series Connection Schottky 30V 200mA Surface Mount TO-236-3, SC-59, SOT-23-3; MF: ON Semiconductor; Price: None; Value: *; Package: SOT-23-3 ON Semiconductor; Availability: Unavailable; SnapEDA_Link: https://www.snapeda.com/parts/BAT54S/ON%20Semiconductor/view-part/1737355/?ref=snap; MP: BAT54S
D7-D14 D42-D44 = PESD3V3L4UW: Low capacitance unidirectional quadruple ESD protection diode arrays
D15-D22 = BAT54S: Diode Array 1 Pair Series Connection Schottky 30V 200mA Surface Mount TO-236-3, SC-59, SOT-23-3; Value: BAT54S; MF: ON Semiconductor; Price: None; Package: SOT-23-3 ON Semiconductor; Availability: Unavailable; SnapEDA_Link: https://www.snapeda.com/parts/BAT54S/ON%20Semiconductor/view-part/1737355/?ref=snap; MP: BAT54S
D23-D26 = BAT54A-7-F: Diode Array 1 Pair Common Anode Schottky 30V 200mA (DC) Surface Mount TO-236-3, SC-59, SOT-23-3; MF: Diodes Inc.; MP: BAT54A-7-F; Package: Custom Package Diodes Inc.; Purchase-URL: https://pricing.snapeda.com/search/part/BAT54A-7-F/?ref=eda; Check_prices: https://www.snapeda.com/parts/BAT54A-7-F/Diodes%20Inc./view-part/120459/?ref=eda; SnapEDA_Link: https://www.snapeda.com/parts/BAT54A-7-F/Diodes%20Inc./view-part/120459/?ref=snap; Availability: Good; Value: *; Price: None
D35 D37 = BAT54STA: Diode Array 1 Pair Series Connection Schottky 30V 200mA _DC_ Surface Mount TO-236-3, SC-59, SOT-23-3; MF: Diodes Inc.; Package: SOT-23 Diodes Inc.; Digi-Key_Part_Number: BAT54SCT-ND; MP: BAT54STA; SnapEDA_Link: https://www.snapeda.com/parts/BAT54STA/Diodes%20Inc./view-part/367987/?ref=snap; Value: *; Digi-Key_Purchase_URL: https://www.digikey.ru/product-detail/en/diodes-incorporated/BAT54STA/BAT54SCT-ND/243050?utm_source=snapeda&utm_medium=aggregator&utm_campaign=symbol
Fid1-Fid3 = Fiducial: Part Number: Fid-Mark; Artikkelnr Noca: N.A.; Manufacturer: *; Manufacturer Part Number: *; Datasheet: *; LatestRevisionDate: 2009-12-12; Pin Count: 1; Publisher: Nordic Semiconductor; Published: 2009-12-12; Value: *; Note: *; Supplier: *; Supplier part number: *; 2nd source Supplier: *; 2nd source part number: *; Footprint Doc: Fiducial; Artikkelnr Simpro: N.A.
J1 = 105017-0001: MF: Molex; Price: None; Package: None; MP: 105017-0001; Value: *; Availability: Unavailable; SnapEDA_Link: https://www.snapeda.com/parts/105017-0001/Molex/view-part/281210/?ref=snap
J2 J4 = PIN3F061.120: Flachstecker Typ tyco/Electronics/AMP   Printed Circuit Board Tabs Source: http://www.buerklin.com; GateName_1: -1; SymbolName_1: PIN; DeviceSetName: PIN3; DeviceName: F061.120; LibraryName: con-faston; MF: MF; MPN: MPN; OC_FARNELL: unknown; OC_NEWARK: unknown
J3 J15-J17 = 1x15P SMT Connector: BOM_Manufacturer: XKB Enterprise; BOM_Manufacturer Part: X2016WRS-10-9TSW; Contributor: LCSC; BOM_Supplier: LCSC; BOM_Supplier Part: C519176; BOM_JLCPCB Part Class: Extended Part; spicePre: C; spiceSymbolName: X2016WRS-10-9TSW
J5 = 22-23-2061: Connector Header Through Hole 6 position 0.100 (2.54mm); MF: Molex; MP: 22-23-2061; Value: *; Check_prices: https://www.snapeda.com/parts/22-23-2061/Molex/view-part/472001/?ref=eda; Package: None; Price: None; SnapEDA_Link: https://www.snapeda.com/parts/22-23-2061/Molex/view-part/472001/?ref=snap
J6 J47 J48 J51 J52 = 22-23-2021: Connector Header Through Hole 2 position 0.100 (2.54mm); MP: 22232021; MF: Molex; Package: None; Check_prices: https://www.snapeda.com/parts/22232021/Molex/view-part/4299878/?ref=eda; Availability: Unavailable; Price: None; Value: *; SnapEDA_Link: https://www.snapeda.com/parts/22232021/Molex/view-part/4299878/?ref=snap
J7 J18 J19 J49 = 22-23-2041: Connector Header Through Hole 4 position 0.100 (2.54mm); MF: Molex; Check_prices: https://www.snapeda.com/parts/22-23-2041/Molex/view-part/438493/?ref=eda; Price: None; Purchase-URL: https://pricing.snapeda.com/search/part/22-23-2041/?ref=eda; Availability: Warning; Package: None; SnapEDA_Link: https://www.snapeda.com/parts/22-23-2041/Molex/view-part/438493/?ref=snap; MP: 22-23-2041; Value: *
J8 J20 J21 J29 = Header 8: Header, 8-Pin; LatestRevisionDate: 17-Jul-2002; LatestRevisionNote: Re-released for DXP Platform.; Publisher: Altium Limited
J9-J11 = 61300311121: WR-PHD Pin Header, THT, Vertical, pitch 2.54mm, 1 Row, 3P; Manufacturer: Wurth Elektronik; Contact Resistance: 20mΩ; Rated Current: 3A; Working Voltage: 250V; Withstanding Voltage: 500V; ComponentLink1Description: Website Link; ComponentLink1URL: https://www.we-online.com/redexpert/article/61300311121?ad; ComponentLink2Description: Datasheet Link; ComponentLink2URL: https://www.we-online.com/redexpert/spec/61300311121?ad; Manufacturer Part Number: 61300311121; Category: Board-to-Board Connectors; Match Code: WR-PHD; Mount: Through Hole; Operating Temperature Max: 105°C; Operating Temperature Min: -40°C; Packaging: Bag; Gender: Pin Header; Number of Pins: 3; Number of Rows: 1; Orientation: Vertical; Pitch: 2.54mm
J28 = DM3AT-SF-PEJM5: CONN MICRO SD CARD PUSH-PUSH R/A; MF: Hirose; Price: None; SnapEDA_Link: https://www.snapeda.com/parts/DM3AT-SF-PEJM5/Hirose%20Electric%20Co%20Ltd/view-part/1223877/?ref=snap; Availability: Unavailable; MP: DM3AT-SF-PEJM5; Package: None; Value: *
J30-J33 = Header 17X2: Header, 17-Pin, Dual row; LatestRevisionDate: 17-Jul-2002; LatestRevisionNote: Re-released for DXP Platform.; Publisher: Altium Limited
L2 = FB-M1331: CIM10J601NC; GateName_1: G$1; SymbolName_1: FB; DeviceName: -M1331; LibraryName: inductors-jwmiller; DeviceSetName: FB
L3-L7 L17 = FB-M1331: BBPY00160808601Y00; GateName_1: G$1; SymbolName_1: FB; DeviceName: -M1331; LibraryName: inductors-jwmiller; DeviceSetName: FB
LED1-LED4 LED13-LED15 = SML-LXT0805IW-TR: LED GREEN CLEAR 0805 SMD; MF: Lumex Opto/Components; Value: *; Package: 0805 Lumex; Price: None; MP: SML-LXT0805IW-TR; Availability: Unavailable; SnapEDA_Link: https://www.snapeda.com/parts/SML-LXT0805IW-TR/Lumex%20Opto/Components%20Inc./view-part/340416/?ref=snap
LED6 LED10 = SML-LXT0805IW-TR: LED RED CLEAR 0805 SMD; MF: Lumex Opto/Components; Value: *; Package: 0805 Lumex; Price: None; MP: SML-LXT0805IW-TR; Availability: Unavailable; SnapEDA_Link: https://www.snapeda.com/parts/SML-LXT0805IW-TR/Lumex%20Opto/Components%20Inc./view-part/340416/?ref=snap
Q1-Q5 Q8 Q9 = PDTC114ET,215: TRANS PREBIAS NPN 250MW TO236AB
Q6 Q7 = BC847B-7-F
R1 R2 R29 R34 = Res2: RES SMD 2K OHM 5% 1/10W 0603; Value: 1K; Published: 8-Jun-2000; LatestRevisionDate: 17-Jul-2002; LatestRevisionNote: Re-released for DXP Platform.; PackageReference: AXIAL-0.4; Publisher: Altium Limited; PackageDescription: Axial Device, Thru-Hole; 2 Leads; 0.4 in Pin Spacing
R3 R11 R35 R36 = Res2: RES 1.2K OHM 5% 1/10W 0603; Value: 1K; Published: 8-Jun-2000; LatestRevisionDate: 17-Jul-2002; LatestRevisionNote: Re-released for DXP Platform.; PackageReference: AXIAL-0.4; Publisher: Altium Limited; PackageDescription: Axial Device, Thru-Hole; 2 Leads; 0.4 in Pin Spacing
R4 R7 R12 R14-R18 R20 R22-R24 R27 R31-R33 R37 R39-R43 R45-R47 R52-R59 R66-R72 R74-R80 R163-R166 = RES: RES 100 OHM 5% 1/10W 0603; 名称: 贴片电阻
R5 R6 R8-R10 R13 R28 R30 R48-R51 R83 R98 = Res2: RES 1K OHM 5% 1/10W 0603; Published: 8-Jun-2000; LatestRevisionDate: 17-Jul-2002; LatestRevisionNote: Re-released for DXP Platform.; PackageReference: AXIAL-0.4; Publisher: Altium Limited; PackageDescription: Axial Device, Thru-Hole; 2 Leads; 0.4 in Pin Spacing
  R28 R30 R48-R51 R83 R98: Value: 1K
R19 R21 R84 R94-R96 = RES: RES 0 OHM JUMPER 1/10W 0603; 名称: 贴片电阻
R25 R26 R60-R62 R65 R73 R86 R128 R157 R158 R161 R162 = Res2: RES 10K OHM 5% 1/10W 0603; Value: 1K; Published: 8-Jun-2000; LatestRevisionDate: 17-Jul-2002; LatestRevisionNote: Re-released for DXP Platform.; PackageReference: AXIAL-0.4; Publisher: Altium Limited; PackageDescription: Axial Device, Thru-Hole; 2 Leads; 0.4 in Pin Spacing
R38 R44 = Res2: CRCW08054K70FKEA; Value: 1K; Published: 8-Jun-2000; LatestRevisionDate: 17-Jul-2002; LatestRevisionNote: Re-released for DXP Platform.; PackageReference: AXIAL-0.4; Publisher: Altium Limited; PackageDescription: Axial Device, Thru-Hole; 2 Leads; 0.4 in Pin Spacing
R63 R64 R81 R82 R85 R88 R102 R143 R144 R148-R154 = RES: RC0805FR-071KL; 名称: 贴片电阻
R87 R89-R93 = RES: RES 330K OHM 5% 1/10W 0603; 名称: 贴片电阻
R101 = Res2: RES SMD 100K OHM 5% 1/10W 0603; Published: 8-Jun-2000; LatestRevisionDate: 17-Jul-2002; LatestRevisionNote: Re-released for DXP Platform.; PackageReference: AXIAL-0.4; Publisher: Altium Limited; PackageDescription: Axial Device, Thru-Hole; 2 Leads; 0.4 in Pin Spacing
R167-R170 = Res2: RES 100 OHM 5% 1/10W 0603; Value: 1K; Published: 8-Jun-2000; LatestRevisionDate: 17-Jul-2002; LatestRevisionNote: Re-released for DXP Platform.; PackageReference: AXIAL-0.4; Publisher: Altium Limited; PackageDescription: Axial Device, Thru-Hole; 2 Leads; 0.4 in Pin Spacing
RN1 RN3 = TC164-JR-0747RL: RES ARRAY 4 RES 47 OHM 0804; MF: Yageo; Value: *; Availability: Warning; Package: 1206 Yageo; SnapEDA_Link: https://www.snapeda.com/parts/TC164-JR-0747RL/Yageo/view-part/499156/?ref=snap; Price: None; Check_prices: https://www.snapeda.com/parts/TC164-JR-0747RL/Yageo/view-part/499156/?ref=eda; Purchase-URL: https://pricing.snapeda.com/search/part/TC164-JR-0747RL/?ref=eda; MP: TC164-JR-0747RL
S1 = 4 Position Dip Switch: STANDARD DIP SWITCH, 4 POSITIONS; MP: DS01-254-S-04BE; MF: CUI Devices; Price: None; Availability: Bad; Value: *; Check_prices: https://www.snapeda.com/parts/DS01-254-S-04BE/CUI%20Devices/view-part/4467369/?ref=eda; CUI_purchase_URL: https://www.cuidevices.com/product/switches/dip-switches/ds01-254-series?utm_source=snapeda.com&utm_medium=referral&utm_campaign=snapedaBOM; SnapEDA_Link: https://www.snapeda.com/parts/DS01-254-S-04BE/CUI%20Devices/view-part/4467369/?ref=snap; Package: None
U1 = LTV-847S: OPTOISOLTR 5KV 4CH TRANS 16-SMD
U2 = USBLC6-2SC6: MF: STMicroelectronics; Package: SOT-23-6 STMicroelectronics; Availability: Unavailable; Value: *; MP: USBLC6-2SC6; SnapEDA_Link: https://www.snapeda.com/parts/USBLC6-2SC6/STMicroelectronics/view-part/231887/?ref=snap; Price: None
U7 = MX25L6406EM2I-12G: IC FLASH 16MBIT SPI/QUAD 8SOIC
U8 = XB3-24Z8PT-J: RECEPTACLE STRIP 10P 2.0MM PITCH; MF: Digi International; Value: *; Digi-Key_Purchase_URL: https://www.digikey.ch/product-detail/en/digi/XB3-24Z8PT-J/602-2188-ND/8130934?utm_source=snapeda&utm_medium=aggregator&utm_campaign=symbol; MP: XB3-24Z8PT-J; Package: Module Digi International; SnapEDA_Link: https://www.snapeda.com/parts/XB3-24Z8PT-J/Digi%20International/view-part/2751315/?ref=snap; Digi-Key_Part_Number: 602-2188-ND
U27 = BA033CC0FP-E2: Integrated Circuit; Manufacturer_Name: ROHM Semiconductor; Description: LDO regulator,3.3V,1A,TO252; Datasheet Link: http://rohmfs.rohm.com/en/products/databook/datasheet/ic/power/linear_regulator/baxxdd0-e.pdf; Manufacturer_Part_Number: BA033CC0FP-E2; Mouser Part Number: 755-BA033CC0FP-E2; Mouser Price/Stock: https://www.mouser.co.uk/ProductDetail/ROHM-Semiconductor/BA033CC0FP-E2?qs=4kLU8WoGk0vZtk7EcED04A%3D%3D; Arrow Part Number: BA033CC0FP-E2; Arrow Price/Stock: https://www.arrow.com/en/products/ba033cc0fp-e2/rohm-semiconductor?region=nac
U33 = L78M05ABDT-TR: Linear Voltage Regulator IC 1 Output 500mA DPAK; MF: STMicroelectronics; Package: TO-252 STMicroelectronics; Price: None; Value: *; SnapEDA_Link: https://www.snapeda.com/parts/L78M05ABDT-TR/STMicroelectronics/view-part/8115/?ref=snap; MP: L78M05ABDT-TR; DigiKey-Purchase-URL: https://snapeda.com/shop?store=DigiKey&id=8115; Arrow_Electronics-Purchase-URL: https://snapeda.com/shop?store=Arrow+Electronics&id=8115; Availability: Unavailable